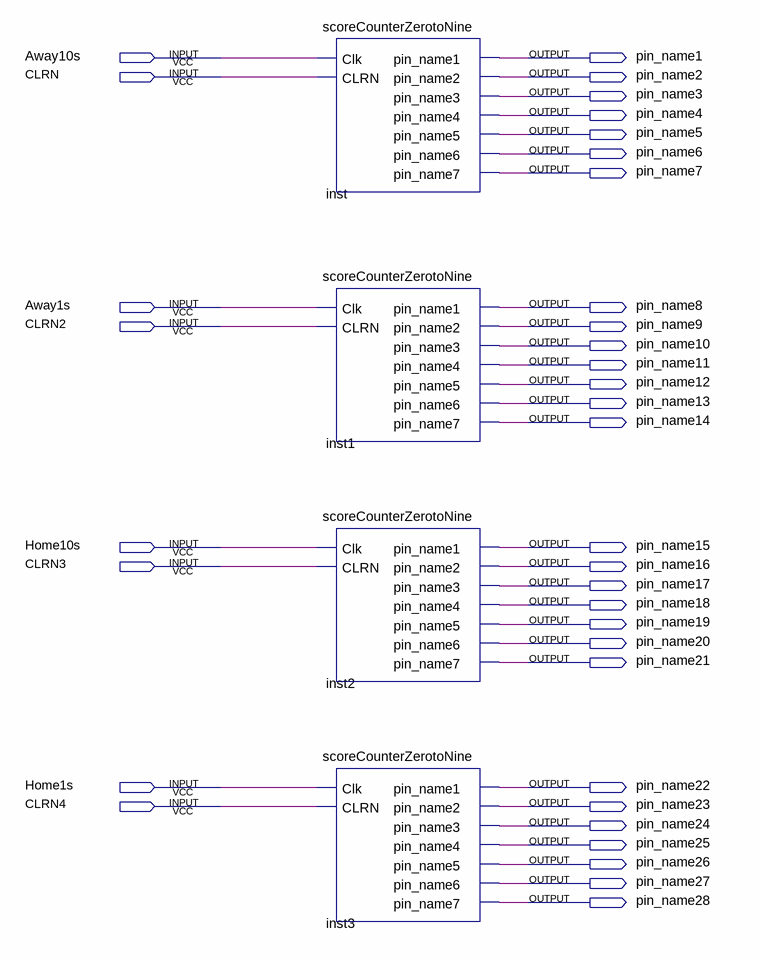
[diagram p0: schematic sheet]
// Quartus schematic counterDisplay.bdf as structural Verilog: 4 symbols, 36 pins
module counterDisplay (
  input  Away10s,
  input  CLRN,
  input  Away1s,
  input  CLRN2,
  input  Home10s,
  input  CLRN3,
  input  Home1s,
  input  CLRN4,
  output pin_name1,
  output pin_name2,
  output pin_name3,
  output pin_name4,
  output pin_name5,
  output pin_name6,
  output pin_name7,
  output pin_name8,
  output pin_name9,
  output pin_name10,
  output pin_name11,
  output pin_name12,
  output pin_name13,
  output pin_name14,
  output pin_name15,
  output pin_name16,
  output pin_name17,
  output pin_name18,
  output pin_name19,
  output pin_name20,
  output pin_name21,
  output pin_name22,
  output pin_name23,
  output pin_name24,
  output pin_name25,
  output pin_name26,
  output pin_name27,
  output pin_name28
);

  scoreCounterZerotoNine inst (
    .Clk(Away10s), .CLRN(CLRN), .pin_name1(pin_name1), .pin_name2(pin_name2), .pin_name3(pin_name3),
    .pin_name4(pin_name4), .pin_name5(pin_name5), .pin_name6(pin_name6), .pin_name7(pin_name7));
  scoreCounterZerotoNine inst1 (
    .Clk(Away1s), .CLRN(CLRN2), .pin_name1(pin_name8), .pin_name2(pin_name9), .pin_name3(pin_name10),
    .pin_name4(pin_name11), .pin_name5(pin_name12), .pin_name6(pin_name13), .pin_name7(pin_name14));
  scoreCounterZerotoNine inst2 (
    .Clk(Home10s), .CLRN(CLRN3), .pin_name1(pin_name15), .pin_name2(pin_name16), .pin_name3(pin_name17),
    .pin_name4(pin_name18), .pin_name5(pin_name19), .pin_name6(pin_name20), .pin_name7(pin_name21));
  scoreCounterZerotoNine inst3 (
    .Clk(Home1s), .CLRN(CLRN4), .pin_name1(pin_name22), .pin_name2(pin_name23), .pin_name3(pin_name24),
    .pin_name4(pin_name25), .pin_name5(pin_name26), .pin_name6(pin_name27), .pin_name7(pin_name28));
endmodule
